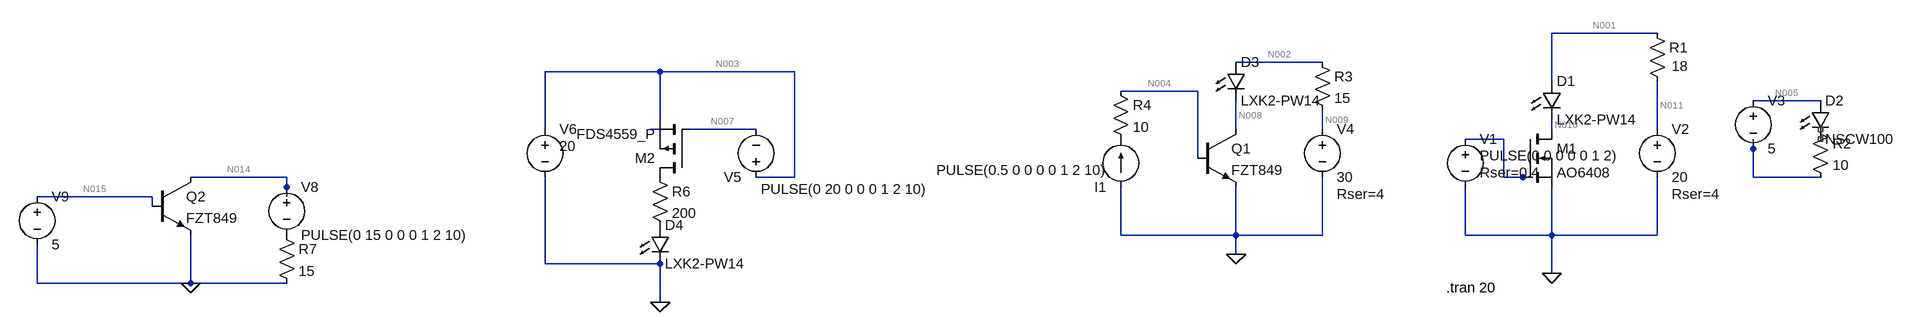
[diagram p0: schematic Draft2.asc]
Draft2.asc, the LTspice schematic file:
Version 4
SHEET 1 980 680
WIRE 384 -80 208 -80
WIRE -176 -32 -320 -32
WIRE -1280 -16 -1472 -16
WIRE -1056 -16 -1280 -16
WIRE 208 0 208 -80
WIRE -384 16 -512 16
WIRE 656 32 544 32
WIRE -1280 64 -1280 -16
WIRE -1472 80 -1472 -16
WIRE -1280 80 -1296 80
WIRE -1120 80 -1232 80
WIRE -320 80 -320 32
WIRE -176 80 -176 48
WIRE 208 80 208 64
WIRE 384 80 384 0
WIRE 128 96 64 96
WIRE 544 112 544 96
WIRE -384 128 -384 16
WIRE -2336 160 -2496 160
WIRE -1056 160 -1056 -16
WIRE -1056 160 -1120 160
WIRE 128 160 128 96
WIRE 160 160 128 160
WIRE 176 160 160 160
WIRE 544 160 544 112
WIRE 656 160 544 160
WIRE -2336 176 -2336 160
WIRE -2560 192 -2752 192
WIRE -2336 192 -2336 176
WIRE -2560 208 -2560 192
WIRE -512 256 -512 176
WIRE -320 256 -320 176
WIRE -320 256 -512 256
WIRE -176 256 -176 160
WIRE -176 256 -320 256
WIRE 64 256 64 176
WIRE 208 256 208 176
WIRE 208 256 64 256
WIRE 384 256 384 160
WIRE 384 256 208 256
WIRE -320 288 -320 256
WIRE -1472 304 -1472 160
WIRE -1280 304 -1280 288
WIRE -1280 304 -1472 304
WIRE 208 320 208 256
WIRE -2752 336 -2752 272
WIRE -2496 336 -2496 256
WIRE -2496 336 -2752 336
WIRE -2336 336 -2496 336
WIRE -1280 368 -1280 304
FLAG 208 320 0
FLAG -320 288 0
FLAG -1280 368 0
FLAG -2496 336 0
SYMBOL nmos 160 80 R0
SYMATTR InstName M1
SYMATTR Value AO6408
SYMBOL LED 192 0 R0
SYMATTR InstName D1
SYMATTR Value LXK2-PW14
SYMBOL res 368 -96 R0
WINDOW 3 40 71 Left 2
SYMATTR Value 18
SYMATTR InstName R1
SYMATTR SpiceLine tol=1 pwr=0.1
SYMBOL voltage 64 80 R0
WINDOW 123 24 44 Left 2
WINDOW 39 24 72 Left 2
WINDOW 3 24 44 Left 2
SYMATTR SpiceLine Rser=0.4
SYMATTR Value PULSE(0 0 0 0 0 1 2)
SYMATTR InstName V1
SYMBOL voltage 384 64 R0
WINDOW 123 0 0 Left 0
WINDOW 39 24 124 Left 2
SYMATTR SpiceLine Rser=4
SYMATTR InstName V2
SYMATTR Value 20
SYMBOL voltage 544 16 R0
WINDOW 123 0 0 Left 0
WINDOW 39 0 0 Left 0
SYMATTR InstName V3
SYMATTR Value 5
SYMBOL LED 640 32 R0
SYMATTR InstName D2
SYMATTR Value NSCW100
SYMBOL res 640 64 R0
SYMATTR InstName R2
SYMATTR Value 10
SYMBOL npn -384 80 R0
SYMATTR InstName Q1
SYMATTR Value FZT849
SYMBOL voltage -176 64 R0
WINDOW 123 0 0 Left 0
WINDOW 39 24 124 Left 2
SYMATTR SpiceLine Rser=4
SYMATTR InstName V4
SYMATTR Value 30
SYMBOL LED -336 -32 R0
SYMATTR InstName D3
SYMATTR Value LXK2-PW14
SYMBOL res -192 -48 R0
SYMATTR InstName R3
SYMATTR Value 15
SYMATTR SpiceLine tol=1 pwr=0.1
SYMBOL res -528 0 R0
SYMATTR InstName R4
SYMATTR Value 10
SYMATTR SpiceLine tol=1 pwr=0.1
SYMBOL current -512 176 R180
WINDOW 3 24 28 Left 2
WINDOW 123 0 0 Left 0
WINDOW 39 0 0 Left 0
SYMATTR Value PULSE(0.5 0 0 0 0 1 2 10)
SYMATTR InstName I1
SYMBOL LED -1296 240 R0
SYMATTR InstName D4
SYMATTR Value LXK2-PW14
SYMBOL voltage -1120 176 R180
WINDOW 3 -285 -4 Left 2
WINDOW 123 0 0 Left 0
WINDOW 39 0 0 Left 0
SYMATTR Value PULSE(0 20 0 0 0 1 2 10)
SYMATTR InstName V5
SYMBOL voltage -1472 64 R0
WINDOW 123 0 0 Left 0
WINDOW 39 0 0 Left 0
WINDOW 3 24 44 Left 2
SYMATTR Value 20
SYMATTR InstName V6
SYMBOL npn -2560 160 R0
SYMATTR InstName Q2
SYMATTR Value FZT849
SYMBOL voltage -2752 176 R0
WINDOW 123 0 0 Left 0
WINDOW 39 0 0 Left 0
SYMATTR InstName V9
SYMATTR Value 5
SYMBOL res -2352 240 R0
SYMATTR InstName R7
SYMATTR Value 15
SYMATTR SpiceLine tol=1 pwr=0.1
SYMBOL voltage -2336 160 R0
WINDOW 123 0 0 Left 0
WINDOW 39 0 0 Left 0
SYMATTR InstName V8
SYMATTR Value PULSE(0 15 0 0 0 1 2 10)
SYMBOL pmos -1232 160 R180
SYMATTR InstName M2
SYMATTR Value FDS4559_P
SYMBOL res -1296 144 R0
SYMATTR InstName R6
SYMATTR Value 200
TEXT 32 344 Left 2 !.tran 20

The netlist it stands for:
* Draft2.asc
M1 N010 N012 0 0 AO6408
D1 N001 N010 LXK2-PW14
R1 N001 N011 18 tol=1 pwr=0.1
V1 N012 0 PULSE(0 0 0 0 0 1 2) Rser=0.4
V2 N011 0 20 Rser=4
V3 N005 N013 5
D2 N005 NC_01 NSCW100
R2 NC_02 N013 10
Q1 N008 N004 0 0 FZT849
V4 N009 0 30 Rser=4
D3 N002 N008 LXK2-PW14
R3 N002 N009 15 tol=1 pwr=0.1
R4 N004 P001 10 tol=1 pwr=0.1
I1 0 P001 PULSE(0.5 0 0 0 0 1 2 10)
D4 P002 0 LXK2-PW14
V5 N003 N007 PULSE(0 20 0 0 0 1 2 10)
V6 N003 0 20
Q2 N014 N015 0 0 FZT849
V9 N015 0 5
R7 P003 0 15 tol=1 pwr=0.1
V8 N014 P003 PULSE(0 15 0 0 0 1 2 10)
M2 P004 N007 N003 N003 FDS4559_P
R6 P004 P002 200
.model D D
.lib standard.dio
.model NPN NPN
.model PNP PNP
.lib standard.bjt
.model NMOS NMOS
.model PMOS PMOS
.lib standard.mos
.tran 20
.backanno
.end

* Results of the author's LTspice run, read from the files saved beside the schematic
* Operating Point, zero values left out:
*   V(n010) = 18.61 V
*   V(n001) = 20 V
*   V(n011) = 20 V
*   V(n005) = 5 V
*   V(n008) = 66.05 mV
*   V(n004) = 877.8 mV
*   V(n009) = 24.55 V
*   V(n002) = 4.136 V
*   V(p001) = 5.878 V
*   V(p002) = 1.167 V
*   V(n003) = 20 V
*   V(n007) = 20 V
*   V(n014) = 1.992 V
*   V(n015) = 5 V
*   V(p003) = 1.992 V
*   V(p004) = 1.167 V
*   Ic(Q2) = -132.8 mA
*   Ib(Q2) = 89.27 A
*   Ie(Q2) = -89.13 A
*   Ic(Q1) = 1.361 A
*   Ib(Q1) = 500 mA
*   Ie(Q1) = -1.861 A
*   Id(M2) = -48.84 pA
*   Is(M2) = 48.84 pA
*   Id(M1) = 982 pA
*   Is(M1) = -982 pA
*   I(D4) = 67.68 pA
*   I(D3) = 1.361 A
*   I(D1) = 1.001 nA
*   I(I1) = 500 mA
*   I(R6) = 67.68 pA
*   I(R7) = 132.8 mA
*   I(R4) = -500 mA
*   I(R3) = -1.361 A
*   I(R1) = -1.001 nA
*   I(V8) = 132.8 mA
*   I(V9) = -89.27 A
*   I(V6) = -67.76 pA
*   I(V4) = -1.361 A
*   I(V2) = -1.001 nA
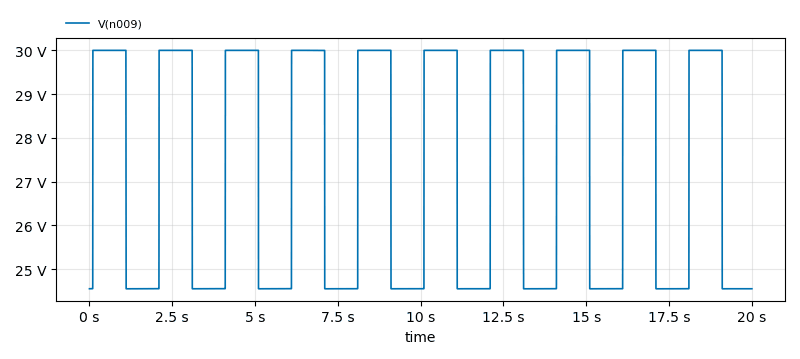
[diagram p1: Transient Analysis of Draft2.asc, plotted from the saved traces]
* Transient Analysis, 1 run:
*   V(n009): min 24.55 V, max 30 V, average 27.28 V, rms 27.42 V, last 24.55 V